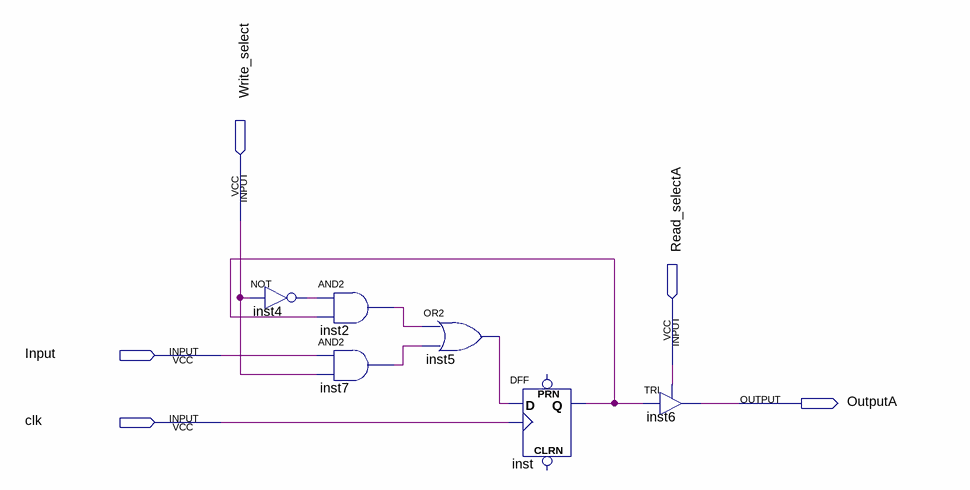
[diagram p0: schematic sheet]
// Quartus schematic RFC-1-OUT.bdf as structural Verilog: 6 symbols, 5 pins
module \RFC-1-OUT  (
  input  Write_select,
  input  Input,
  input  Read_selectA,
  input  clk,
  output OutputA
);

  wire inst2_out, inst4_out, inst5_out, inst7_out, inst_q;

  not inst4 (inst4_out, Write_select);
  and inst2 (inst2_out, inst4_out, inst_q);
  and inst7 (inst7_out, Input, Write_select);
  or inst5 (inst5_out, inst2_out, inst7_out);
  DFF inst (.CLK(clk), .D(inst5_out), .Q(inst_q));  // open: CLRN, PRN
  TRI inst6 (.IN(inst_q), .OE(Read_selectA), .OUT(OutputA));
endmodule
